# Altium project 20240829_WLAN_ESP32.PrjPcb
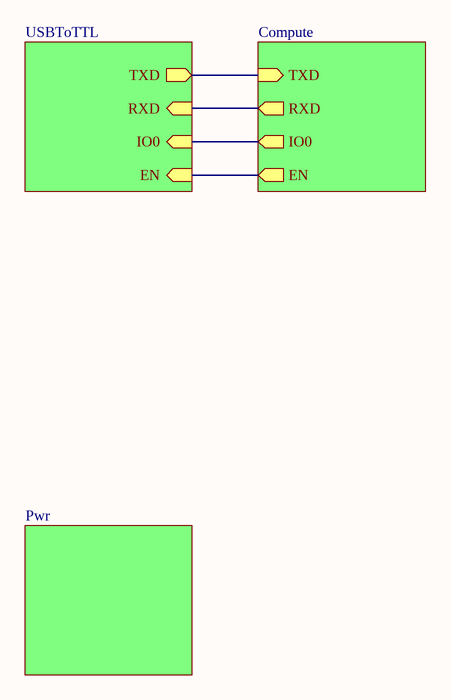
[diagram p0: TOP_Sch.SchDoc]
4 sheets, 28 parts. Net scope: hierarchical (ports join the sheet entries above them; power ports are global).
Board file: 20240913_WLAN_ESP32.PcbDoc
Sheets:
  TOP_Sch.SchDoc
    Designator = USBToTTL.SchDoc
    Designator = Compute.SchDoc
    Designator = Pwr.SchDoc

## Sheet TOP_Sch.SchDoc
size A4; SheetNumber: 1; SheetTotal: 4

### Sub-sheets
Designator = USBToTTL: TXD (out), RXD (in), IO0 (in), EN (in)
Designator = Compute: TXD (in), RXD (out), IO0 (out), EN (out)
Designator = Pwr: no entries

### Nets
EN: sheet Designator/EN, sheet Designator/EN
IO0: sheet Designator/IO0, sheet Designator/IO0
TXD_P: sheet Designator/RXD, sheet Designator/RXD
NetB2_36: sheet Designator/TXD, sheet Designator/TXD

## Sheet USBToTTL.SchDoc
size A4; SheetNumber: 2; SheetTotal: 4
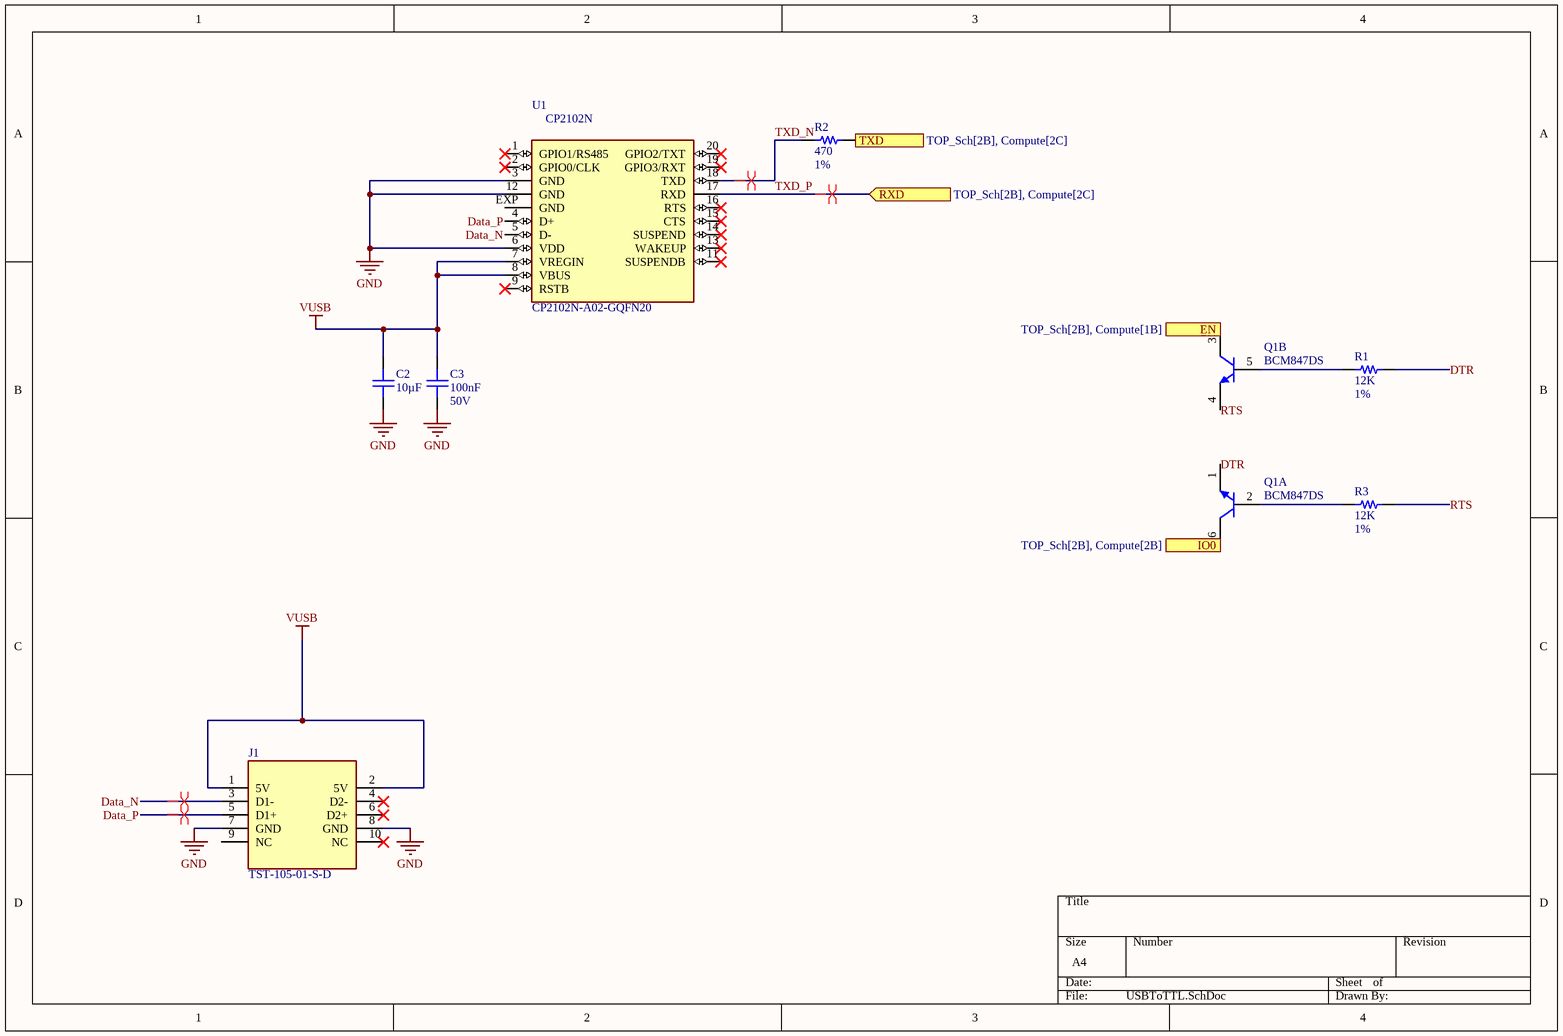
[diagram p1: USBToTTL.SchDoc]

### Parts
C2  value 10µF  [FP-GRM188-0_2-IPC_B]  (hidden comment: GRM188R61E106MA73J)
C3  value 100nF  Voltage Rating: 50V  [CAPC1608X90X35LL15T15]  (hidden comment: 06035C104KAT4A)
J1  TST-105-01-S-D  [TST-105-01-S-D-Footprint-1]
Q1  BCM847DS  [SOT95P275X110-6N]  (parts A,B of 2)
R1  value 12K  Tolerance: 1%  [RESC1608X06L 0603 High Density]  (hidden comment: RC0603FR-0718KL)
R2  value 470  Tolerance: 1%  [RESC1608X06L 0603 High Density]  (hidden comment: RC0603FR-07470RL)
R3  value 12K  Tolerance: 1%  [RESC1608X06L 0603 High Density]  (hidden comment: RC0603FR-0718KL)
U1  CP2102N-A02-GQFN20  [WFQFN-20]

### Ports
EN (in, see TOP_Sch[2B], Compute[1B]), IO0 (in, see TOP_Sch[2B], Compute[2B]), RXD (in, see TOP_Sch[2B], Compute[2C]), TXD (out, see TOP_Sch[2B], Compute[2C])

### Nets
GND: C2.1 C3.1 J1.7(GND) J1.8(GND) U1.3(GND) U1.6(VDD) U1.12(GND)
VUSB: C2.2 C3.2 J1.1(5V) J1.2(5V) U1.7(VREGIN) U1.8(VBUS)
Data_N: J1.3(D1-) U1.5(D-)
Data_P: J1.5(D1+) U1.4(D+)
DTR: Q1.1(E) R1.2
EN: Q1.3(C) ; port EN
IO0: Q1.6(C) ; port IO0
RTS: Q1.4(E) R3.2
TXD_N: R2.1 U1.18(TXD)
TXD_P: U1.17(RXD) ; port RXD
NetB2_36: R2.2 ; port TXD
NetQ1_2: Q1.2(B) R3.1
NetQ1_5: Q1.5(B) R1.1

Not connected (* = marked no-connect by the designer): J1 4(D2-)* 6(D2+)* 9(NC) 10(NC)*; U1 1(GPIO1/RS485)* 2(GPIO0/CLK)* 9(RSTB)* 11(SUSPENDB)* 13(WAKEUP)* 14(SUSPEND)* 15(CTS)* 16(RTS)* 19(GPIO3/RXT)* 20(GPIO2/TXT)* EXP(GND)

### Layout directives
differential pair: Data_N
differential pair; differential pair class USB: Data_P
differential pair; differential pair class TTL: TXD_N, TXD_P

### Notes on the sheet
- (in symbol CP2102N-A02-GQFN20) CP2102N

### Library data of the parts
C2 = CMP-001-00049-1: Ceramic Capacitor, Multilayer, Ceramic, 25V, 20% +Tol, 20% -Tol, X5R, 15% TC, 10uF, Surface Mount, 0603; Multilayer: Yes; Height: 0.8mm; JESD-609 Code: e3; Rated DC Voltage (URdc): 25V; RoHS Compliant: Yes; Pins: 2; Tolerance (fill in as +-): 20%; Temperature Characteristics Code: X5R; Length: 1.6mm; Case/Package: 0603; Mounting Technology: Surface Mount; Termination: Wraparound; Package Shape: Rectangular; Reach SVHC Compliant: Yes; Dielectric Material: Ceramic; Terminal Finish: Nickel; Max Operating Temperature: 85°C; Capacitor Type: Ceramic; Packaging: Tape and Reel; Min Operating Temperature: -55°C; Package Style: SMTMeter; Tolerance  (fill in as +-): 20%; Width: 0.8mm
C3 = CMP-001-00048-2: Ceramic Capacitor, Multilayer, Ceramic, 50V, 10% +Tol, 10% -Tol, X7R, 15% TC, 0.1uF, Surface Mount, 0603; Multilayer: Yes; Capacitance: 100 nF; Temperature Characteristics Code: X7R; Length: 1.6mm; Height: 0.9mm; Packaging: Tape and Reel; Tolerance: 10%; Mounting Technology: Surface Mount; Rated DC Voltage (URdc): 50V; Package Style: SMTMeter; Tolerance (fill in as +-): 10%; RoHS Compliant: Yes; Min Operating Temperature: -55°C; Capacitor Type: Ceramic; JESD-609 Code: e3; Terminal Finish: Nickel; Max Operating Temperature: 125°C; Pins: 2; Tolerance  (fill in as +-): 10%; Width: 0.81mm; Termination: Wraparound; Reach SVHC Compliant: Yes; Dielectric Material: Ceramic; Package Shape: Rectangular; Case/Package: 0603
J1 = CMP-002-00096-2: Board Connector, 10 Contact(s), 2 Row(s), Male, Straight, 0.1 inch Pitch, Solder Terminal, Locking, Black Insulator, Receptacle; RoHS Compliant: Yes; Mounting Technology: Board; Max Operating Temperature: 125°C; Connector Type: BOARD CONNECTOR; Min Operating Temperature: -55°C
Q1 = CMP-011-000000-2: Trans GP BJT NPN 45V 0.1A 6-Pin TSOP T/R; Manufacturer 1: NXP Semiconductors; Manufacturer Part Number 1: BCM847DS,135; Power Dissipation: 380mW; Collector Base Voltage (VCBO): 50V; Transition Frequency: 250MHz; Max Collector Current: 100mA; Element Configuration: Dual; Emitter Base Voltage (VEBO): 6V; Number of Elements: 2; Max Operating Temperature: 150°C; Collector Emitter Breakdown Voltage: 45V; ComponentLink4URL: https://datasheet.ciiva.com/968/bcm847bv-bs-ds-968730.pdf?src-supplier=Digi-Key; ComponentLink1Description: https://datasheet.ciiva.com/4725/bcm847bv-bs-ds-188878-4725172.pdf?src-supplier=Mouser; Min Operating Temperature: -65°C; Package Quantity: 1; ComponentLink5Description: https://datasheet.ciiva.com/11204/bcm847bv-bs-ds-11204107.pdf?src-supplier=Avnet; Collector Emitter Voltage (VCEO): 45V; Case/Package: TSOP; Design Item ID: BCM847DS; Gain Bandwidth Product: 250MHz; ComponentLink3URL: https://datasheet.ciiva.com/968/bcm847bv-bs-ds-968729.pdf?src-supplier=Digi-Key; Mount: Surface Mount; Max Breakdown Voltage: 45V; ComponentLink1URL: https://datasheet.ciiva.com/4725/bcm847bv-bs-ds-188878-4725172.pdf?src-supplier=Mouser; Contact Plating: Tin; Stock 1: 7614; Source: SiCeff_Parameter_V2.SCHLIB; ComponentLink2URL: https://datasheet.ciiva.com/968/bcm847bv-bs-ds-968728.pdf?src-supplier=Digi-Key; Number of Pins: 6; RoHS: Yes; ComponentLink5URL: https://datasheet.ciiva.com/11204/bcm847bv-bs-ds-11204107.pdf?src-supplier=Avnet; ComponentLink2Description: https://datasheet.ciiva.com/968/bcm847bv-bs-ds-968728.pdf?src-supplier=Digi-Key; Category: BJTs; Max Power Dissipation: 380mW; Pin Count: 6; ComponentLink3Description: https://datasheet.ciiva.com/968/bcm847bv-bs-ds-968729.pdf?src-supplier=Digi-Key; Component Type: Standard; Pricing 1: 1=0,43000, 10=0,32700, 25=0,29520, 100=0,15560, 250=0,15396, 500=0,13788, 1000=0,10730, 2500=0,09818, 5000=0,09389 (USD); Frequency: 250MHz; ComponentLink4Description: https://datasheet.ciiva.com/968/bcm847bv-bs-ds-968730.pdf?src-supplier=Digi-Key; Packaging: Tape and Reel; Radiation Hardening: No; Polarity: NPN
R1 R3 = CMP-009-00172-1: SMD Chip Resistor, 18 kOhm, ± 1%, 100 mW, 0603 [1608 Metric], Thick Film, General Purpose; Power: 100mW; Temperature Coefficient: 100ppm/°C; Voltage Rating: 75V; Max Operating Temperature: 155°C; Mounting Technology: Surface Mount; Case/Package: 0603; RoHS Compliant: Yes; Depth: 0.8mm; Height: 0.45mm; Min Operating Temperature: -55°C; Length: 1.6mm; Pins: 2
R2 = CMP-009-00156-1: Res Thick Film 0603 470 Ohm 1% 0.1W(1/10W) ±100ppm/C Pad SMD T/R; Voltage Rating: 50V; Power: 100mW; Temperature Coefficient: 100ppm/°C; Min Operating Temperature: -55°C; Depth: 0.8mm; Max Operating Temperature: 155°C; Length: 0.063inch; Pins: 2; Case/Package: 0603; Mounting Technology: Surface Mount; Height: 0.022inch; RoHS Compliant: Yes
U1 = CP2102N-A02-GQFN20: USB Bridge, USB to UART USB 2.0 UART Interface 20-QFN (3x3); MF: Silicon Labs; Package: WFQFN-20 Silicon Labs; Price: None; Check_prices: https://www.snapeda.com/parts/CP2102N-A02-GQFN20/Silicon+Labs/view-part/?ref=eda; Value: *; SnapEDA_Link: https://www.snapeda.com/parts/CP2102N-A02-GQFN20/Silicon+Labs/view-part/?ref=snap; MP: CP2102N-A02-GQFN20; Availability: In Stock; Purchase-URL: https://pricing.snapeda.com/search/part/CP2102N-A02-GQFN20/?ref=eda

## Sheet Compute.SchDoc
size A4; SheetNumber: 4; SheetTotal: 4
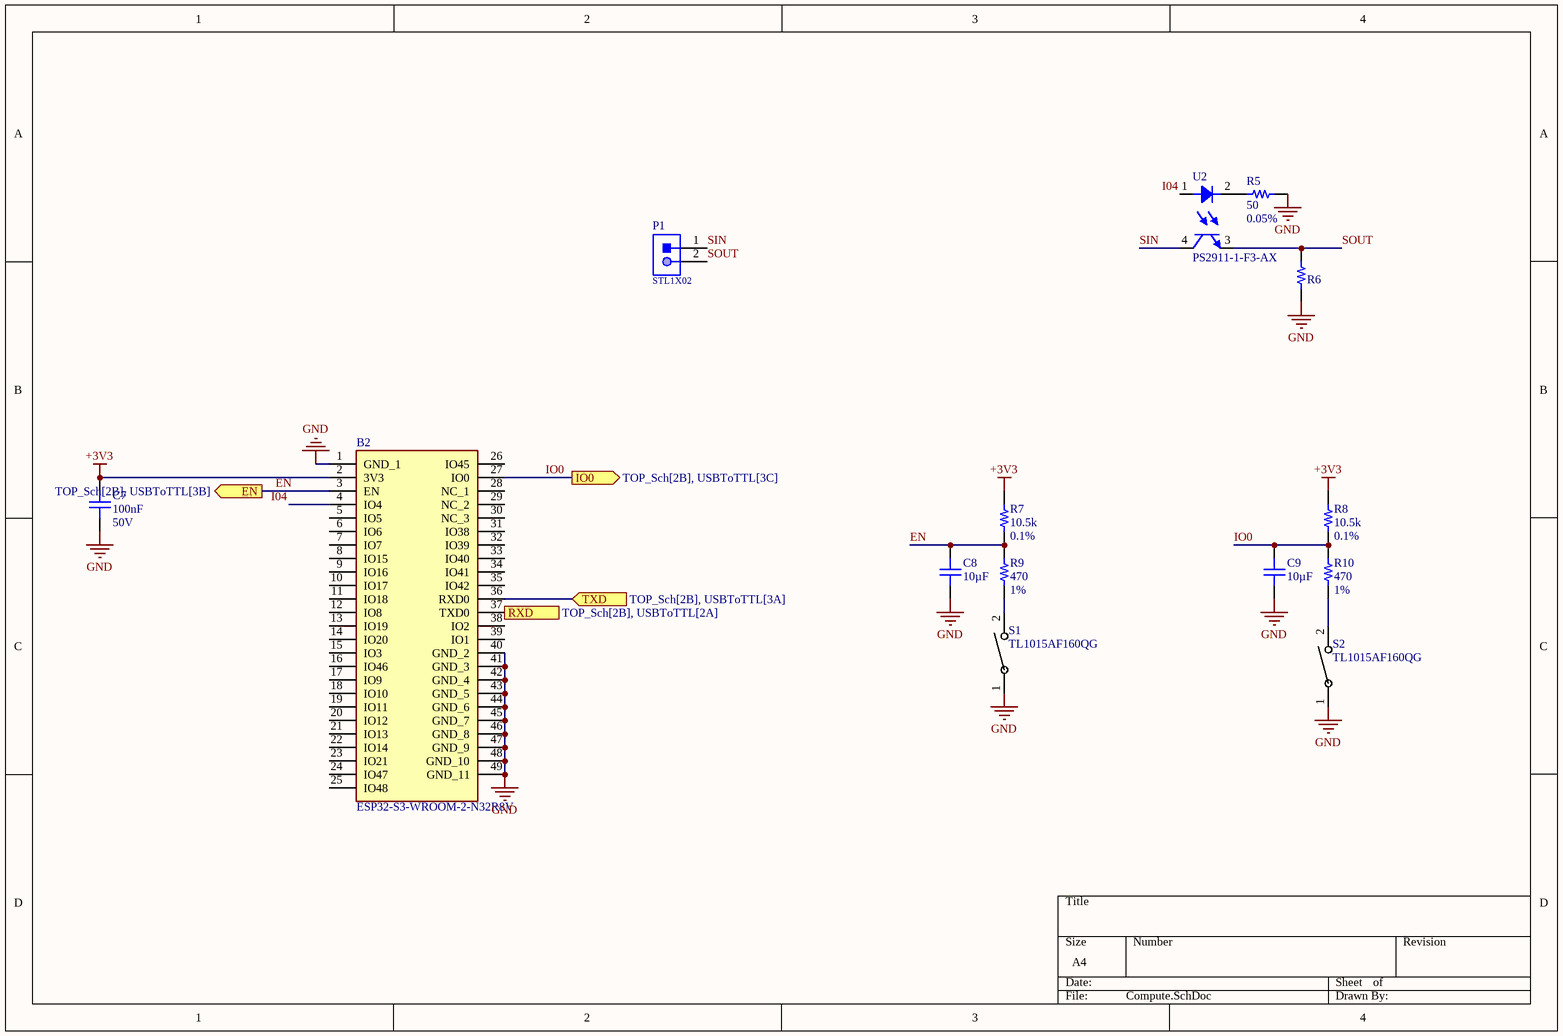
[diagram p2: Compute.SchDoc]

### Parts
B2  ESP32-S3-WROOM-2-N32R8V  [ESP32S3WROOM2N32R8V]
C7  value 100nF  Voltage Rating: 50V  [CAPC1608X90X35LL15T15]  (hidden comment: 06035C104KAT4A)
C8  value 10µF  [FP-GRM188-0_2-IPC_B]  (hidden comment: GRM188R61E106MA73J)
C9  value 10µF  [FP-GRM188-0_2-IPC_B]  (hidden comment: GRM188R61E106MA73J)
P1  STL1X02  [TSW-102-07-XXX-S]
R5  value 50  Tolerance: 0.05%  [FP-RG1608-MFG]  (hidden comment: RC-5kOhm)
R6  CR0603-JW-101ELF  [FP-CR0603-IPC_A]  (value not drawn)
R7  value 10.5k  Tolerance: 0.1%  [RESC1608X06N 0603 Medium Density]  (hidden comment: RG1608P-1052-B-T5)
R8  value 10.5k  Tolerance: 0.1%  [RESC1608X06N 0603 Medium Density]  (hidden comment: RG1608P-1052-B-T5)
R9  value 470  Tolerance: 1%  [RESC1608X06N 0603 Medium Density]  (hidden comment: RC0603FR-07470RL)
R10  value 470  Tolerance: 1%  [RESC1608X06N 0603 Medium Density]  (hidden comment: RC0603FR-07470RL)
S1  TL1015AF160QG  [SW_F160QG_EWI]
S2  TL1015AF160QG  [SW_F160QG_EWI]
U2  PS2911-1-F3-AX  [PS2911-1-F3-AX-Footprint-1]

### Ports
EN (out, see TOP_Sch[2B], USBToTTL[3B]), IO0 (out, see TOP_Sch[2B], USBToTTL[3C]), RXD (out, see TOP_Sch[2B], USBToTTL[2A]), TXD (in, see TOP_Sch[2B], USBToTTL[3A])

### Nets
+3V3: B2.2(3V3) C7.2 R7.2 R8.2
GND: B2.1(GND_1) B2.40(GND_2) B2.41(GND_3) B2.42(GND_4) B2.43(GND_5) B2.44(GND_6) B2.45(GND_7) B2.46(GND_8) B2.47(GND_9) B2.48(GND_10) B2.49(GND_11) C7.1 C8.1 C9.1 R5.2 R6.1 S1.1 S2.1
EN: B2.3(EN) C8.2 R7.1 R9.2 ; port EN
I04: B2.4(IO4) U2.1
IO0: B2.27(IO0) C9.2 R8.1 R10.2 ; port IO0
SIN: P1.1 U2.4
SOUT: P1.2 R6.2 U2.3
TXD_P: B2.37(TXD0) ; port RXD
NetB2_36: B2.36(RXD0) ; port TXD
NetR5_1: R5.1 U2.2
NetR9_1: R9.1 S1.2
NetR10_1: R10.1 S2.2

Not connected (* = marked no-connect by the designer): B2 5(IO5) 6(IO6) 7(IO7) 8(IO15) 9(IO16) 10(IO17) 11(IO18) 12(IO8) 13(IO19) 14(IO20) 15(IO3) 16(IO46) 17(IO9) 18(IO10) 19(IO11) 20(IO12) 21(IO13) 22(IO14) 23(IO21) 24(IO47) 25(IO48) 26(IO45) 28(NC_1) 29(NC_2) 30(NC_3) 31(IO38) 32(IO39) 33(IO40) 34(IO41) 35(IO42) 38(IO2) 39(IO1)

### Library data of the parts
B2 = ESP32-S3-WROOM-2-N32R8V: WiFi Modules - 802.11 [ENGINEERING SAMPLES] SMD Module, ESP32-S3R8 with 1.8V 8 MB Octal PSRAM, 32 MB Octal SPI Flash, PCB Antenna; Manufacturer_Name: Espressif Systems; Geometry.Height: 3.25mm; Mouser Part Number: 356-ESP3S3WRM2N32R8V; Mouser Price/Stock: https://www.mouser.co.uk/ProductDetail/Espressif-Systems/ESP32-S3-WROOM-2-N32R8V?qs=Li%252BoUPsLEntC3FaT%2FvCeug%3D%3D; Manufacturer_Part_Number: ESP32-S3-WROOM-2-N32R8V; Datasheet Link: https://www.espressif.com/sites/default/files/documentation/esp32-s3-wroom-2_datasheet_en.pdf
C7 = CMP-001-00048-2: as C3 on sheet USBToTTL; Temperature Characteristics Code: X7R; Length: 1.6mm; Height: 0.9mm; Packaging: Tape and Reel; Tolerance: 10%; Mounting Technology: Surface Mount; Rated DC Voltage (URdc): 50V; Package Style: SMTMeter; Tolerance (fill in as +-): 10%; RoHS Compliant: Yes; Min Operating Temperature: -55°C; Capacitor Type: Ceramic; JESD-609 Code: e3; Terminal Finish: Nickel; Max Operating Temperature: 125°C; Pins: 2; Tolerance  (fill in as +-): 10%; Width: 0.81mm; Termination: Wraparound; Reach SVHC Compliant: Yes; Dielectric Material: Ceramic; Package Shape: Rectangular; Case/Package: 0603
C8 C9 = CMP-001-00049-1: as C2 on sheet USBToTTL; Height: 0.8mm; JESD-609 Code: e3; Rated DC Voltage (URdc): 25V; RoHS Compliant: Yes; Pins: 2; Tolerance (fill in as +-): 20%; Temperature Characteristics Code: X5R; Length: 1.6mm; Case/Package: 0603; Mounting Technology: Surface Mount; Termination: Wraparound; Package Shape: Rectangular; Reach SVHC Compliant: Yes; Dielectric Material: Ceramic; Terminal Finish: Nickel; Max Operating Temperature: 85°C; Capacitor Type: Ceramic; Packaging: Tape and Reel; Min Operating Temperature: -55°C; Package Style: SMTMeter; Tolerance  (fill in as +-): 20%; Width: 0.8mm
P1 = CMP-061-000008-4: Stiftleiste, 2-Pin; Pin Count: 2; Source: Pin_Header.SchLib; Design Item ID: STL1X02; Component Type: Standard
R5 = CMP-009-00170-1: RES SMD 5 kOHM 0.05% 1/10W 0603; Voltage Rating: 75V; Resistance: 680R; Power Rating: 62.5mW; Working Voltage: 100V; Temperature Coefficient: 10ppm/°C; Max Power Dissipation: 100mW; Packaging: Tape and Reel; Series: RG; Height: 0.02inch; Case Code (Imperial): 0603; Technology: THIN FILM; Weight: 7.1E-05oz; Construction: Rectangular; Termination: SMD/SMT; Military Standard: Not; Number of Terminations: 2; Voltage Rating (DC): 75V; Package Quantity: 1; Case Code (Metric): 1608; Lead Free: Lead Free; Resistor Type: Thin Film; Features: Automotive AEC-Q200; Length: 0.063inch; Width: 0.031inch; Max Operating Temperature: 155°C; Depth: 0.8mm; Min Operating Temperature: -55°C; RoHS Compliant: Yes; Case/Package: 0603
R6 = CMP-009-00203-1: Fixed Resistor, Metal Glaze/thick Film, 0.1W, 100ohm, 75V, 5% +/-Tol, 200ppm/Cel, Surface Mount, 0603; Power: 100mW; Value: 100; Tolerance: 5%; Min Operating Temperature: -55°C; Max Operating Temperature: 155°C; Pins: 2; JLCPCB Part #: C913237; RoHS Compliant: Yes; Mounting Technology: Surface Mount; Case/Package: 0603
R7 R8 = CMP-009-00046-3: TR / Thin Film Chip Resistors 0603 size, 1/10W, 10.5K ohm, 0.1%, 25ppm; Temperature Coefficient: 25ppm/°C; Resistance: 10.5kR; Max Power Dissipation: 100mW; Voltage Rating (DC): 75V; Voltage Rating: 100V; Packaging: Tape and Reel; Case Code (Imperial): 0603; Case Code (Metric): 1608; Case/Package: 0603; Termination: SMD/SMT; Height: 0.4mm; RoHS Compliant: Yes; Resistor Type: Thin Film; Max Operating Temperature: 155°C; Width: 0.8mm; Features: Automotive AEC-Q200,Anti-Sulfur; Weight: 7.1E-05oz; Length: 1.6mm; Power Rating: 100mW; Min Operating Temperature: -55°C; Lead Free: Lead Free; Number of Terminations: 2; Series: RG
R9 R10 = CMP-009-00156-1: as R2 on sheet USBToTTL; Min Operating Temperature: -55°C; Depth: 0.8mm; Max Operating Temperature: 155°C; Length: 0.063inch; Pins: 2; Case/Package: 0603; Mounting Technology: Surface Mount; Height: 0.022inch; RoHS Compliant: Yes
S1 S2 = TL1015AF160QG: No Description Available; Mfr_Name: E-Switch
U2 = CMP-00026-00000-3: RENESAS - PS2911-1-F3-AX - OPTOKOPPLER,TR O/P,USOP-4

## Sheet Pwr.SchDoc
size A4; SheetNumber: 3; SheetTotal: 4
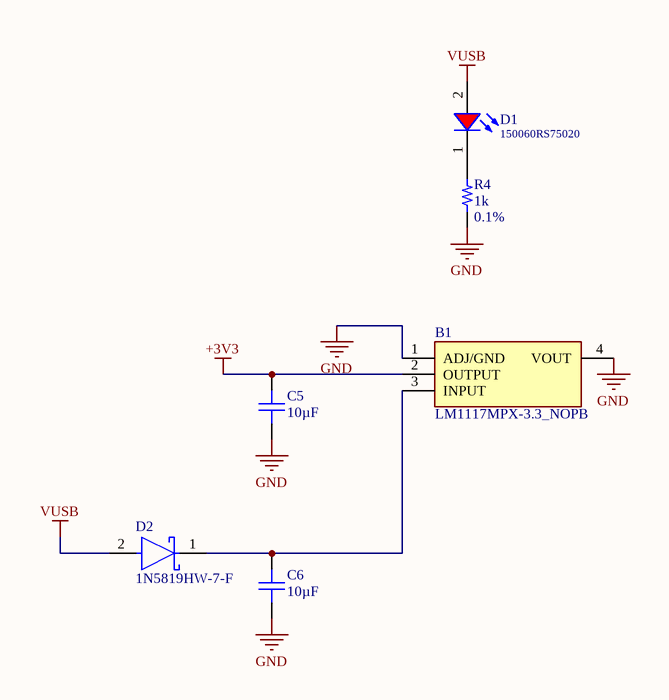
[diagram p3: Pwr.SchDoc]

### Parts
B1  LM1117MPX-3.3_NOPB  [SOT230P700X180-4N]
C5  value 10µF  [FP-GRM188-0_2-IPC_B]  (hidden comment: GRM188R61E106MA73J)
C6  value 10µF  [FP-GRM188-0_2-IPC_B]  (hidden comment: GRM188R61E106MA73J)
D1  150060RS75020  [WL-SMCW_0603_H=0.25mm]
D2  1N5819HW-7-F  [FP-SOD123-IPC_A]
R4  value 1k  Tolerance: 0.1%  [RESC1608X06L 0603 High Density]  (hidden comment: RG1608P-102-B-T5)

### Nets
+3V3: B1.2(OUTPUT) C5.2
GND: B1.1(ADJ/GND) B1.4(VOUT) C5.1 C6.1 R4.1
VUSB: D1.2(A) D2.2(A)
NetB1_3: B1.3(INPUT) C6.2 D2.1(C)
NetD1_1: D1.1(K) R4.2

### Library data of the parts
B1 = LM1117MPX-3.3_NOPB: Space saving 800-mA low-dropout linear regulator with internal current limit; Manufacturer_Name: Texas Instruments; Manufacturer_Part_Number: LM1117MPX-3.3/NOPB; Geometry.Height: 1.8mm; Mouser Part Number: 926-LM1117MPX3.3NOPB; Mouser Price/Stock: https://www.mouser.co.uk/ProductDetail/Texas-Instruments/LM1117MPX-3.3-NOPB?qs=X1J7HmVL2ZHRbBIxXi4utg%3D%3D; Datasheet Link: http://www.ti.com/lit/ds/symlink/lm1117.pdf
C5 C6 = CMP-001-00049-1: as C2 on sheet USBToTTL; Height: 0.8mm; JESD-609 Code: e3; Rated DC Voltage (URdc): 25V; RoHS Compliant: Yes; Pins: 2; Tolerance (fill in as +-): 20%; Temperature Characteristics Code: X5R; Length: 1.6mm; Case/Package: 0603; Mounting Technology: Surface Mount; Termination: Wraparound; Package Shape: Rectangular; Reach SVHC Compliant: Yes; Dielectric Material: Ceramic; Terminal Finish: Nickel; Max Operating Temperature: 85°C; Capacitor Type: Ceramic; Packaging: Tape and Reel; Min Operating Temperature: -55°C; Package Style: SMTMeter; Tolerance  (fill in as +-): 20%; Width: 0.8mm
D1 = CMP-029-000007-2: WL-SMCW SMT Mono-color Chip LED Waterclear, size 0603, Red, 2V, 140deg; Chip Technology: AlInGaP; Luminous Intensity typ.: 100mcd; Peak Wavelength typ.: 630nm; Dominant Wavelength typ.: 625nm; Publisher: Wurth Elektronik; ComponentLink1Description: Manufacturer; Emitting Color: Red; ComponentLink2URL: https://www.we-online.com/catalog/datasheet/150060RS75020.pdf; Published Date: March 2020; ComponentLink1URL: http://www.we-online.de; Mounting Technology: SMT; Forward Voltage typ.: 2V; Operating Temperature: -40 to +85degC; Size: 0603; Source: WL-SMCW_0603.SchLib; Packaging: Tape and Reel; Viewing Angle: 140deg; Part Number: 150060RS75020; Design Item ID: 150060RS75020; ComponentLink2Description: Datasheet
D2 = CMP-0303-00003-3: DIODE SCHOTTKY 40V 1A SOD123; Forward Voltage: 450mV; Capacitance: 110pF; Max Forward Surge Current (Ifsm): 25A; Peak Reverse Current: 50uA; Polarity: Standard; Element Configuration: Single; Max Power Dissipation: 450mW; Min Operating Temperature: -65°C; Package Quantity: 3000; Contact Plating: Tin; Weight: 0.000353oz; Max Repetitive Reverse Voltage (Vrrm): 40V; Max Reverse Voltage (DC): 40V; Height: 1.25mm; Average Rectified Current: 1A; Width: 1.7mm; Case/Package: SOD-123-2; Lead Free: Lead Free; Max Operating Temperature: 125°C; Current Rating: 1A; Termination: SMD/SMT; Forward Current: 1A; Radiation Hardening: No; Number of Pins: 2; Length: 2.85mm; Voltage Rating (DC): 40V; REACH SVHC: No SVHC; Peak Non-Repetitive Surge Current: 25A; Packaging: Tape and Reel; Output Current: 1A
R4 = CMP-009-00031-4: SUSUMU - RG1608P-102-B-T5 - RES, THIN FILM, 1K, 0.1%, 0.1W, 0603; Max Power Dissipation: 100mW; Resistance: 1kR; Voltage Rating (DC): 75V; Voltage Rating: 100V; Temperature Coefficient: 25ppm/°C; Length: 1.6mm; Features: Automotive AEC-Q200,Anti-Sulfur; Depth: 0.8mm; Construction: Rectangular; Number of Terminations: 2; Width: 0.8mm; Lead Free: Lead Free; Weight: 7.1E-05oz; Height: 0.4mm; RoHS Compliant: Yes; Termination: SMD/SMT; Power Rating: 100mW; Min Operating Temperature: -55°C; Case/Package: 0603; Case Code (Imperial): 0603; Military Standard: Not; Resistor Type: Thin Film; Max Operating Temperature: 155°C; Working Voltage: 100V; Series: RG; Technology: THIN FILM; Packaging: Tape and Reel; Case Code (Metric): 1608

## Nets that join several sheets
+3V3: Compute (B2.2 C7.2 R7.2 R8.2), Pwr (B1.2 C5.2)
GND: USBToTTL (7 pins), Compute (18 pins), Pwr (5 pins)
VUSB: USBToTTL (6 pins), Pwr (D1.2 D2.2)
EN: USBToTTL (Q1.3), Compute (B2.3 C8.2 R7.1 R9.2)
IO0: USBToTTL (Q1.6), Compute (B2.27 C9.2 R8.1 R10.2)
NetB2_36: USBToTTL (R2.2), Compute (B2.36)
TXD_P: USBToTTL (U1.17), Compute (B2.37)